# EAGLE board TestBoardExport (EAGLE 6.4)
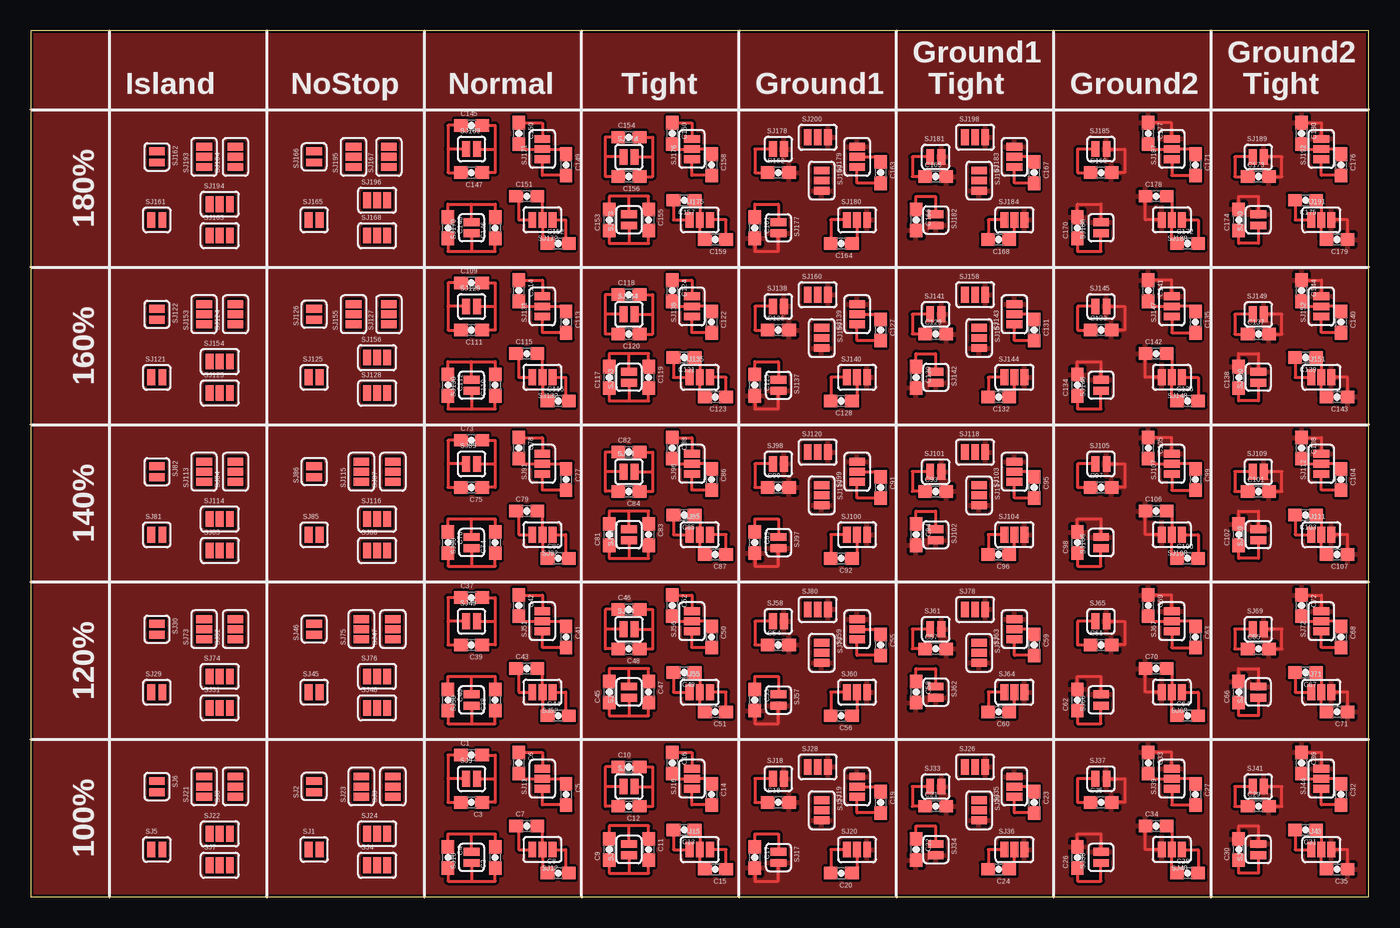
[diagram p3: board, top side]

Size 107.95 x 69.85 mm. Coordinates in mm from the lower left corner, seen from the top.
Outline: 0,0 107.95,0 107.95,69.85 0,69.85 0,0
Copper layers (1*16): Top 0.035mm / dielectric 1.5mm / Bottom 0.035mm
Design rules "SparkFun-2-layer": minimum track width 7mil, minimum drill 15mil, track to track 8mil, track to pad 8mil, pad to pad 8mil, via to via 8mil, smd to smd 8mil, copper to edge 8mil, drill to drill 8mil, minimum pad ring 12mil, minimum via ring 10mil, stop-mask expansion 4mil, vias tented up to drill 20mil, thermal gap 10mil

## Footprints (pad centres in the part's own frame; a part is rotated, then mirrored left to right if it is on the bottom)
0603-CAP = smd 1.1 x 1: 1 -0.85,0; 2 0.85,0
PAD-JUMPER-2-NO_NO_SILK = smd 0.635 x 1.27: 1 -0.45,0; 2 0.45,0
PAD-JUMPER-3-NO_YES_SILK = smd 0.635 x 1.27: 1 -0.813,0; 2 0,0; 3 0.813,0
PAD-JUMPER-3-NO_YES_SILK_ALL = smd 0.635 x 1.27: 1 -0.813,0; 2 0,0; 3 0.813,0
PAD-JUMPER-2-NO_NO_SILK_20 = smd 0.635 x 1.27: 1 -0.45,0; 2 0.45,0
PAD-JUMPER-3-NO_YES_SILK_20 = smd 0.635 x 1.27: 1 -0.813,0; 2 0,0; 3 0.813,0
PAD-JUMPER-3-NO_YES_SILK_ALL_20 = smd 0.635 x 1.27: 1 -0.813,0; 2 0,0; 3 0.813,0
PAD-JUMPER-2-NO_NO_SILK_40 = smd 0.635 x 1.27: 1 -0.45,0; 2 0.45,0
PAD-JUMPER-3-NO_YES_SILK_40 = smd 0.635 x 1.27: 1 -0.813,0; 2 0,0; 3 0.813,0
PAD-JUMPER-3-NO_YES_SILK_ALL_40 = smd 0.635 x 1.27: 1 -0.813,0; 2 0,0; 3 0.813,0
PAD-JUMPER-2-NO_NO_SILK_60 = smd 0.635 x 1.27: 1 -0.45,0; 2 0.45,0
PAD-JUMPER-3-NO_YES_SILK_60 = smd 0.635 x 1.27: 1 -0.813,0; 2 0,0; 3 0.813,0
PAD-JUMPER-3-NO_YES_SILK_ALL_60 = smd 0.635 x 1.27: 1 -0.813,0; 2 0,0; 3 0.813,0
PAD-JUMPER-2-NO_NO_SILK_80 = smd 0.635 x 1.27: 1 -0.45,0; 2 0.45,0
PAD-JUMPER-3-NO_YES_SILK_80 = smd 0.635 x 1.27: 1 -0.813,0; 2 0,0; 3 0.813,0
PAD-JUMPER-3-NO_YES_SILK_ALL_80 = smd 0.635 x 1.27: 1 -0.813,0; 2 0,0; 3 0.813,0

## Placement (x,y rotation side)
C1  0.1uF  [0603-CAP]  35.56,11.43 0 top
C2  0.1uF  [0603-CAP]  37.46,3.17 90 top
C3  0.1uF  [0603-CAP]  35.56,7.62 180 top
C4  0.1uF  [0603-CAP]  33.66,3.17 270 top
C5  0.1uF  [0603-CAP]  43.18,8.26 270 top
C6  0.1uF  [0603-CAP]  39.37,10.79 270 top
C7  0.1uF  [0603-CAP]  40.01,5.71 0 top
C8  0.1uF  [0603-CAP]  42.55,1.91 0 top
C9  0.1uF  [0603-CAP]  46.67,3.81 90 top
C10  0.1uF  [0603-CAP]  48.26,10.48 0 top
C11  0.1uF  [0603-CAP]  49.85,3.81 270 top
C12  0.1uF  [0603-CAP]  48.26,7.3 180 top
C13  0.1uF  [0603-CAP]  52.7,5.4 180 top
C14  0.1uF  [0603-CAP]  54.93,8.26 270 top
C15  0.1uF  [0603-CAP]  55.25,2.22 180 top
C16  0.1uF  [0603-CAP]  51.75,10.79 270 top
C17  0.1uF  [0603-CAP]  58.42,3.17 270 top
C18  0.1uF  [0603-CAP]  60.33,7.62 0 top
C19  0.1uF  [0603-CAP]  68.58,7.62 270 top
C20  0.1uF  [0603-CAP]  65.41,1.91 180 top
C21  0.1uF  [0603-CAP]  73.02,7.3 0 top
C22  0.1uF  [0603-CAP]  71.44,3.81 270 top
C23  0.1uF  [0603-CAP]  80.96,7.62 270 top
C24  0.1uF  [0603-CAP]  78.1,2.22 180 top
C25  0.1uF  [0603-CAP]  86.36,7.62 0 top
C26  0.1uF  [0603-CAP]  84.45,3.17 90 top
C27  0.1uF  [0603-CAP]  93.98,8.26 270 top
C28  0.1uF  [0603-CAP]  93.34,1.91 0 top
C29  0.1uF  [0603-CAP]  99.06,7.3 0 top
C30  0.1uF  [0603-CAP]  97.47,3.81 90 top
C31  0.1uF  [0603-CAP]  102.87,5.4 180 top
C32  0.1uF  [0603-CAP]  105.73,8.26 270 top
C33  0.1uF  [0603-CAP]  90.17,10.79 270 top
C34  0.1uF  [0603-CAP]  90.8,5.71 0 top
C35  0.1uF  [0603-CAP]  105.41,2.22 180 top
C36  0.1uF  [0603-CAP]  102.55,10.79 270 top
C37  0.1uF  [0603-CAP]  35.56,24.13 0 top
C38  0.1uF  [0603-CAP]  37.46,15.88 90 top
C39  0.1uF  [0603-CAP]  35.56,20.32 180 top
C40  0.1uF  [0603-CAP]  33.66,15.88 270 top
C41  0.1uF  [0603-CAP]  43.18,20.95 270 top
C42  0.1uF  [0603-CAP]  39.37,23.5 270 top
C43  0.1uF  [0603-CAP]  40.01,18.41 0 top
C44  0.1uF  [0603-CAP]  42.55,14.61 0 top
C45  0.1uF  [0603-CAP]  46.67,16.51 90 top
C46  0.1uF  [0603-CAP]  48.26,23.18 0 top
C47  0.1uF  [0603-CAP]  49.85,16.51 270 top
C48  0.1uF  [0603-CAP]  48.26,20 180 top
C49  0.1uF  [0603-CAP]  52.7,18.1 180 top
C50  0.1uF  [0603-CAP]  54.93,20.95 270 top
C51  0.1uF  [0603-CAP]  55.25,14.92 180 top
C52  0.1uF  [0603-CAP]  51.75,23.5 270 top
C53  0.1uF  [0603-CAP]  58.42,15.88 270 top
C54  0.1uF  [0603-CAP]  60.33,20.32 0 top
C55  0.1uF  [0603-CAP]  68.58,20.32 270 top
C56  0.1uF  [0603-CAP]  65.41,14.61 180 top
C57  0.1uF  [0603-CAP]  73.02,20 0 top
C58  0.1uF  [0603-CAP]  71.44,16.51 270 top
C59  0.1uF  [0603-CAP]  80.96,20.32 270 top
C60  0.1uF  [0603-CAP]  78.1,14.92 180 top
C61  0.1uF  [0603-CAP]  86.36,20.32 0 top
C62  0.1uF  [0603-CAP]  84.45,15.88 90 top
C63  0.1uF  [0603-CAP]  93.98,20.95 270 top
C64  0.1uF  [0603-CAP]  93.34,14.61 0 top
C65  0.1uF  [0603-CAP]  99.06,20 0 top
C66  0.1uF  [0603-CAP]  97.47,16.51 90 top
C67  0.1uF  [0603-CAP]  102.87,18.1 180 top
C68  0.1uF  [0603-CAP]  105.73,20.95 270 top
C69  0.1uF  [0603-CAP]  90.17,23.5 270 top
C70  0.1uF  [0603-CAP]  90.8,18.41 0 top
C71  0.1uF  [0603-CAP]  105.41,14.92 180 top
C72  0.1uF  [0603-CAP]  102.55,23.5 270 top
C73  0.1uF  [0603-CAP]  35.56,36.83 0 top
C74  0.1uF  [0603-CAP]  37.46,28.57 90 top
C75  0.1uF  [0603-CAP]  35.56,33.02 180 top
C76  0.1uF  [0603-CAP]  33.66,28.57 270 top
C77  0.1uF  [0603-CAP]  43.18,33.66 270 top
C78  0.1uF  [0603-CAP]  39.37,36.2 270 top
C79  0.1uF  [0603-CAP]  40.01,31.11 0 top
C80  0.1uF  [0603-CAP]  42.55,27.3 0 top
C81  0.1uF  [0603-CAP]  46.67,29.21 90 top
C82  0.1uF  [0603-CAP]  48.26,35.88 0 top
C83  0.1uF  [0603-CAP]  49.85,29.21 270 top
C84  0.1uF  [0603-CAP]  48.26,32.7 180 top
C85  0.1uF  [0603-CAP]  52.7,30.8 180 top
C86  0.1uF  [0603-CAP]  54.93,33.66 270 top
C87  0.1uF  [0603-CAP]  55.25,27.62 180 top
C88  0.1uF  [0603-CAP]  51.75,36.2 270 top
C89  0.1uF  [0603-CAP]  58.42,28.57 270 top
C90  0.1uF  [0603-CAP]  60.33,33.02 0 top
C91  0.1uF  [0603-CAP]  68.58,33.02 270 top
C92  0.1uF  [0603-CAP]  65.41,27.3 180 top
C93  0.1uF  [0603-CAP]  73.02,32.7 0 top
C94  0.1uF  [0603-CAP]  71.44,29.21 270 top
C95  0.1uF  [0603-CAP]  80.96,33.02 270 top
C96  0.1uF  [0603-CAP]  78.1,27.62 180 top
C97  0.1uF  [0603-CAP]  86.36,33.02 0 top
C98  0.1uF  [0603-CAP]  84.45,28.57 90 top
C99  0.1uF  [0603-CAP]  93.98,33.66 270 top
C100  0.1uF  [0603-CAP]  93.34,27.3 0 top
C101  0.1uF  [0603-CAP]  99.06,32.7 0 top
C102  0.1uF  [0603-CAP]  97.47,29.21 90 top
C103  0.1uF  [0603-CAP]  102.87,30.8 180 top
C104  0.1uF  [0603-CAP]  105.73,33.66 270 top
C105  0.1uF  [0603-CAP]  90.17,36.2 270 top
C106  0.1uF  [0603-CAP]  90.8,31.11 0 top
C107  0.1uF  [0603-CAP]  105.41,27.62 180 top
C108  0.1uF  [0603-CAP]  102.55,36.2 270 top
C109  0.1uF  [0603-CAP]  35.56,49.53 0 top
C110  0.1uF  [0603-CAP]  37.46,41.27 90 top
C111  0.1uF  [0603-CAP]  35.56,45.72 180 top
C112  0.1uF  [0603-CAP]  33.66,41.27 270 top
C113  0.1uF  [0603-CAP]  43.18,46.35 270 top
C114  0.1uF  [0603-CAP]  39.37,48.9 270 top
C115  0.1uF  [0603-CAP]  40.01,43.81 0 top
C116  0.1uF  [0603-CAP]  42.55,40.01 0 top
C117  0.1uF  [0603-CAP]  46.67,41.91 90 top
C118  0.1uF  [0603-CAP]  48.26,48.58 0 top
C119  0.1uF  [0603-CAP]  49.85,41.91 270 top
C120  0.1uF  [0603-CAP]  48.26,45.4 180 top
C121  0.1uF  [0603-CAP]  52.7,43.5 180 top
C122  0.1uF  [0603-CAP]  54.93,46.35 270 top
C123  0.1uF  [0603-CAP]  55.25,40.32 180 top
C124  0.1uF  [0603-CAP]  51.75,48.9 270 top
C125  0.1uF  [0603-CAP]  58.42,41.27 270 top
C126  0.1uF  [0603-CAP]  60.33,45.72 0 top
C127  0.1uF  [0603-CAP]  68.58,45.72 270 top
C128  0.1uF  [0603-CAP]  65.41,40.01 180 top
C129  0.1uF  [0603-CAP]  73.02,45.4 0 top
C130  0.1uF  [0603-CAP]  71.44,41.91 270 top
C131  0.1uF  [0603-CAP]  80.96,45.72 270 top
C132  0.1uF  [0603-CAP]  78.1,40.32 180 top
C133  0.1uF  [0603-CAP]  86.36,45.72 0 top
C134  0.1uF  [0603-CAP]  84.45,41.27 90 top
C135  0.1uF  [0603-CAP]  93.98,46.35 270 top
C136  0.1uF  [0603-CAP]  93.34,40.01 0 top
C137  0.1uF  [0603-CAP]  99.06,45.4 0 top
C138  0.1uF  [0603-CAP]  97.47,41.91 90 top
C139  0.1uF  [0603-CAP]  102.87,43.5 180 top
C140  0.1uF  [0603-CAP]  105.73,46.35 270 top
C141  0.1uF  [0603-CAP]  90.17,48.9 270 top
C142  0.1uF  [0603-CAP]  90.8,43.81 0 top
C143  0.1uF  [0603-CAP]  105.41,40.32 180 top
C144  0.1uF  [0603-CAP]  102.55,48.9 270 top
C145  0.1uF  [0603-CAP]  35.56,62.23 0 top
C146  0.1uF  [0603-CAP]  37.46,53.98 90 top
C147  0.1uF  [0603-CAP]  35.56,58.42 180 top
C148  0.1uF  [0603-CAP]  33.66,53.98 270 top
C149  0.1uF  [0603-CAP]  43.18,59.05 270 top
C150  0.1uF  [0603-CAP]  39.37,61.59 270 top
C151  0.1uF  [0603-CAP]  40.01,56.52 0 top
C152  0.1uF  [0603-CAP]  42.55,52.7 0 top
C153  0.1uF  [0603-CAP]  46.67,54.61 90 top
C154  0.1uF  [0603-CAP]  48.26,61.28 0 top
C155  0.1uF  [0603-CAP]  49.85,54.61 270 top
C156  0.1uF  [0603-CAP]  48.26,58.1 180 top
C157  0.1uF  [0603-CAP]  52.7,56.2 180 top
C158  0.1uF  [0603-CAP]  54.93,59.05 270 top
C159  0.1uF  [0603-CAP]  55.25,53.02 180 top
C160  0.1uF  [0603-CAP]  51.75,61.59 270 top
C161  0.1uF  [0603-CAP]  58.42,53.98 270 top
C162  0.1uF  [0603-CAP]  60.33,58.42 0 top
C163  0.1uF  [0603-CAP]  68.58,58.42 270 top
C164  0.1uF  [0603-CAP]  65.41,52.7 180 top
C165  0.1uF  [0603-CAP]  73.02,58.1 0 top
C166  0.1uF  [0603-CAP]  71.44,54.61 270 top
C167  0.1uF  [0603-CAP]  80.96,58.42 270 top
C168  0.1uF  [0603-CAP]  78.1,53.02 180 top
C169  0.1uF  [0603-CAP]  86.36,58.42 0 top
C170  0.1uF  [0603-CAP]  84.45,53.98 90 top
C171  0.1uF  [0603-CAP]  93.98,59.05 270 top
C172  0.1uF  [0603-CAP]  93.34,52.7 0 top
C173  0.1uF  [0603-CAP]  99.06,58.1 0 top
C174  0.1uF  [0603-CAP]  97.47,54.61 90 top
C175  0.1uF  [0603-CAP]  102.87,56.2 180 top
C176  0.1uF  [0603-CAP]  105.73,59.05 270 top
C177  0.1uF  [0603-CAP]  90.17,61.59 270 top
C178  0.1uF  [0603-CAP]  90.8,56.52 0 top
C179  0.1uF  [0603-CAP]  105.41,53.02 180 top
C180  0.1uF  [0603-CAP]  102.55,61.59 270 top
SJ1  JUMPER-PAD-2-NO  [PAD-JUMPER-2-NO_NO_SILK]  22.86,3.81 0 top
SJ2  JUMPER-PAD-2-NO  [PAD-JUMPER-2-NO_NO_SILK]  22.86,8.89 90 top
SJ3  JUMPER-PAD-3-NOYES_SILK  [PAD-JUMPER-3-NO_YES_SILK]  29.21,8.89 90 top
SJ4  JUMPER-PAD-3-NOYES_SILK  [PAD-JUMPER-3-NO_YES_SILK]  27.94,2.54 0 top
SJ5  JUMPER-PAD-2-NO  [PAD-JUMPER-2-NO_NO_SILK]  10.16,3.81 0 top
SJ6  JUMPER-PAD-2-NO  [PAD-JUMPER-2-NO_NO_SILK]  10.16,8.89 270 top
SJ7  JUMPER-PAD-3-NOYES_SILK  [PAD-JUMPER-3-NO_YES_SILK]  15.24,2.54 0 top
SJ8  JUMPER-PAD-3-NOYES_SILK  [PAD-JUMPER-3-NO_YES_SILK]  16.51,8.89 90 top
SJ9  JUMPER-PAD-2-NO  [PAD-JUMPER-2-NO_NO_SILK]  35.56,9.53 0 top
SJ10  JUMPER-PAD-2-NO  [PAD-JUMPER-2-NO_NO_SILK]  35.56,3.17 90 top
SJ11  JUMPER-PAD-3-NOYES_SILK  [PAD-JUMPER-3-NO_YES_SILK]  41.27,9.53 90 top
SJ12  JUMPER-PAD-3-NOYES_SILK  [PAD-JUMPER-3-NO_YES_SILK]  41.27,3.81 180 top
SJ13  JUMPER-PAD-2-NO  [PAD-JUMPER-2-NO_NO_SILK]  48.26,3.81 90 top
SJ14  JUMPER-PAD-2-NO  [PAD-JUMPER-2-NO_NO_SILK]  48.26,8.89 0 top
SJ15  JUMPER-PAD-3-NOYES_SILK  [PAD-JUMPER-3-NO_YES_SILK]  53.98,3.81 0 top
SJ16  JUMPER-PAD-3-NOYES_SILK  [PAD-JUMPER-3-NO_YES_SILK]  53.34,9.53 90 top
SJ17  JUMPER-PAD-2-NO  [PAD-JUMPER-2-NO_NO_SILK]  60.33,3.17 270 top
SJ18  JUMPER-PAD-2-NO  [PAD-JUMPER-2-NO_NO_SILK]  60.33,9.53 0 top
SJ19  JUMPER-PAD-3-NOYES_SILK  [PAD-JUMPER-3-NO_YES_SILK]  66.67,8.89 90 top
SJ20  JUMPER-PAD-3-NOYES_SILK  [PAD-JUMPER-3-NO_YES_SILK]  66.67,3.81 0 top
SJ21  JUMPER-PAD-3-NO3_0  [PAD-JUMPER-3-NO_YES_SILK_ALL]  13.97,8.89 90 top
SJ22  JUMPER-PAD-3-NO3_0  [PAD-JUMPER-3-NO_YES_SILK_ALL]  15.24,5.08 0 top
SJ23  JUMPER-PAD-3-NO3_0  [PAD-JUMPER-3-NO_YES_SILK_ALL]  26.67,8.89 90 top
SJ24  JUMPER-PAD-3-NO3_0  [PAD-JUMPER-3-NO_YES_SILK_ALL]  27.94,5.08 0 top
SJ25  JUMPER-PAD-3-NO3_0  [PAD-JUMPER-3-NO_YES_SILK_ALL]  76.52,6.99 270 top
SJ26  JUMPER-PAD-3-NO3_0  [PAD-JUMPER-3-NO_YES_SILK_ALL]  76.2,10.48 0 top
SJ27  JUMPER-PAD-3-NO3_0  [PAD-JUMPER-3-NO_YES_SILK_ALL]  63.82,6.99 270 top
SJ28  JUMPER-PAD-3-NO3_0  [PAD-JUMPER-3-NO_YES_SILK_ALL]  63.5,10.48 0 top
SJ29  JUMPER-PAD-2-NO20  [PAD-JUMPER-2-NO_NO_SILK_20]  10.16,16.51 0 top
SJ30  JUMPER-PAD-2-NO20  [PAD-JUMPER-2-NO_NO_SILK_20]  10.16,21.59 270 top
SJ31  JUMPER-PAD-3-NO2_20  [PAD-JUMPER-3-NO_YES_SILK_20]  15.24,15.24 0 top
SJ32  JUMPER-PAD-3-NO2_20  [PAD-JUMPER-3-NO_YES_SILK_20]  16.51,21.59 90 top
SJ33  JUMPER-PAD-2-NO  [PAD-JUMPER-2-NO_NO_SILK]  73.02,8.89 0 top
SJ34  JUMPER-PAD-2-NO  [PAD-JUMPER-2-NO_NO_SILK]  73.02,3.81 270 top
SJ35  JUMPER-PAD-3-NOYES_SILK  [PAD-JUMPER-3-NO_YES_SILK]  79.38,8.89 90 top
SJ36  JUMPER-PAD-3-NOYES_SILK  [PAD-JUMPER-3-NO_YES_SILK]  79.38,3.81 0 top
SJ37  JUMPER-PAD-2-NO  [PAD-JUMPER-2-NO_NO_SILK]  86.36,9.53 0 top
SJ38  JUMPER-PAD-2-NO  [PAD-JUMPER-2-NO_NO_SILK]  86.36,3.17 90 top
SJ39  JUMPER-PAD-3-NOYES_SILK  [PAD-JUMPER-3-NO_YES_SILK]  92.07,9.53 90 top
SJ40  JUMPER-PAD-3-NOYES_SILK  [PAD-JUMPER-3-NO_YES_SILK]  92.07,3.81 180 top
SJ41  JUMPER-PAD-2-NO  [PAD-JUMPER-2-NO_NO_SILK]  99.06,8.89 0 top
SJ42  JUMPER-PAD-2-NO  [PAD-JUMPER-2-NO_NO_SILK]  99.06,3.81 90 top
SJ43  JUMPER-PAD-3-NOYES_SILK  [PAD-JUMPER-3-NO_YES_SILK]  104.14,3.81 0 top
SJ44  JUMPER-PAD-3-NOYES_SILK  [PAD-JUMPER-3-NO_YES_SILK]  104.14,9.53 90 top
SJ45  JUMPER-PAD-2-NO20  [PAD-JUMPER-2-NO_NO_SILK_20]  22.86,16.51 0 top
SJ46  JUMPER-PAD-2-NO20  [PAD-JUMPER-2-NO_NO_SILK_20]  22.86,21.59 90 top
SJ47  JUMPER-PAD-3-NO2_20  [PAD-JUMPER-3-NO_YES_SILK_20]  29.21,21.59 90 top
SJ48  JUMPER-PAD-3-NO2_20  [PAD-JUMPER-3-NO_YES_SILK_20]  27.94,15.24 0 top
SJ49  JUMPER-PAD-2-NO20  [PAD-JUMPER-2-NO_NO_SILK_20]  35.56,22.23 0 top
SJ50  JUMPER-PAD-2-NO20  [PAD-JUMPER-2-NO_NO_SILK_20]  35.56,15.88 90 top
SJ51  JUMPER-PAD-3-NO2_20  [PAD-JUMPER-3-NO_YES_SILK_20]  41.27,22.23 90 top
SJ52  JUMPER-PAD-3-NO2_20  [PAD-JUMPER-3-NO_YES_SILK_20]  41.27,16.51 180 top
SJ53  JUMPER-PAD-2-NO20  [PAD-JUMPER-2-NO_NO_SILK_20]  48.26,16.51 90 top
SJ54  JUMPER-PAD-2-NO20  [PAD-JUMPER-2-NO_NO_SILK_20]  48.26,21.59 0 top
SJ55  JUMPER-PAD-3-NO2_20  [PAD-JUMPER-3-NO_YES_SILK_20]  53.98,16.51 0 top
SJ56  JUMPER-PAD-3-NO2_20  [PAD-JUMPER-3-NO_YES_SILK_20]  53.34,22.23 90 top
SJ57  JUMPER-PAD-2-NO20  [PAD-JUMPER-2-NO_NO_SILK_20]  60.33,15.88 270 top
SJ58  JUMPER-PAD-2-NO20  [PAD-JUMPER-2-NO_NO_SILK_20]  60.33,22.23 0 top
SJ59  JUMPER-PAD-3-NO2_20  [PAD-JUMPER-3-NO_YES_SILK_20]  66.67,21.59 90 top
SJ60  JUMPER-PAD-3-NO2_20  [PAD-JUMPER-3-NO_YES_SILK_20]  66.67,16.51 0 top
SJ61  JUMPER-PAD-2-NO20  [PAD-JUMPER-2-NO_NO_SILK_20]  73.02,21.59 0 top
SJ62  JUMPER-PAD-2-NO20  [PAD-JUMPER-2-NO_NO_SILK_20]  73.02,16.51 270 top
SJ63  JUMPER-PAD-3-NO2_20  [PAD-JUMPER-3-NO_YES_SILK_20]  79.38,21.59 90 top
SJ64  JUMPER-PAD-3-NO2_20  [PAD-JUMPER-3-NO_YES_SILK_20]  79.38,16.51 0 top
SJ65  JUMPER-PAD-2-NO20  [PAD-JUMPER-2-NO_NO_SILK_20]  86.36,22.23 0 top
SJ66  JUMPER-PAD-2-NO20  [PAD-JUMPER-2-NO_NO_SILK_20]  86.36,15.88 90 top
SJ67  JUMPER-PAD-3-NO2_20  [PAD-JUMPER-3-NO_YES_SILK_20]  92.07,22.23 90 top
SJ68  JUMPER-PAD-3-NO2_20  [PAD-JUMPER-3-NO_YES_SILK_20]  92.07,16.51 180 top
SJ69  JUMPER-PAD-2-NO  [PAD-JUMPER-2-NO_NO_SILK]  99.06,21.59 0 top
SJ70  JUMPER-PAD-2-NO  [PAD-JUMPER-2-NO_NO_SILK]  99.06,16.51 90 top
SJ71  JUMPER-PAD-3-NO2_20  [PAD-JUMPER-3-NO_YES_SILK_20]  104.14,16.51 0 top
SJ72  JUMPER-PAD-3-NO2_20  [PAD-JUMPER-3-NO_YES_SILK_20]  104.14,22.23 90 top
SJ73  JUMPER-PAD-3-NO3_20  [PAD-JUMPER-3-NO_YES_SILK_ALL_20]  13.97,21.59 90 top
SJ74  JUMPER-PAD-3-NO3_20  [PAD-JUMPER-3-NO_YES_SILK_ALL_20]  15.24,17.78 0 top
SJ75  JUMPER-PAD-3-NO3_20  [PAD-JUMPER-3-NO_YES_SILK_ALL_20]  26.67,21.59 90 top
SJ76  JUMPER-PAD-3-NO3_20  [PAD-JUMPER-3-NO_YES_SILK_ALL_20]  27.94,17.78 0 top
SJ77  JUMPER-PAD-3-NO3_20  [PAD-JUMPER-3-NO_YES_SILK_ALL_20]  76.52,19.68 270 top
SJ78  JUMPER-PAD-3-NO3_20  [PAD-JUMPER-3-NO_YES_SILK_ALL_20]  76.2,23.18 0 top
SJ79  JUMPER-PAD-3-NO3_20  [PAD-JUMPER-3-NO_YES_SILK_ALL_20]  63.82,19.68 270 top
SJ80  JUMPER-PAD-3-NO3_20  [PAD-JUMPER-3-NO_YES_SILK_ALL_20]  63.5,23.18 0 top
SJ81  JUMPER-PAD-2-NO40  [PAD-JUMPER-2-NO_NO_SILK_40]  10.16,29.21 0 top
SJ82  JUMPER-PAD-2-NO40  [PAD-JUMPER-2-NO_NO_SILK_40]  10.16,34.29 270 top
SJ83  JUMPER-PAD-3-NO2_40  [PAD-JUMPER-3-NO_YES_SILK_40]  15.24,27.94 0 top
SJ84  JUMPER-PAD-3-NO2_40  [PAD-JUMPER-3-NO_YES_SILK_40]  16.51,34.29 90 top
SJ85  JUMPER-PAD-2-NO40  [PAD-JUMPER-2-NO_NO_SILK_40]  22.86,29.21 0 top
SJ86  JUMPER-PAD-2-NO40  [PAD-JUMPER-2-NO_NO_SILK_40]  22.86,34.29 90 top
SJ87  JUMPER-PAD-3-NO2_40  [PAD-JUMPER-3-NO_YES_SILK_40]  29.21,34.29 90 top
SJ88  JUMPER-PAD-3-NO2_40  [PAD-JUMPER-3-NO_YES_SILK_40]  27.94,27.94 0 top
SJ89  JUMPER-PAD-2-NO40  [PAD-JUMPER-2-NO_NO_SILK_40]  35.56,34.92 0 top
SJ90  JUMPER-PAD-2-NO40  [PAD-JUMPER-2-NO_NO_SILK_40]  35.56,28.57 90 top
SJ91  JUMPER-PAD-3-NO2_40  [PAD-JUMPER-3-NO_YES_SILK_40]  41.27,34.92 90 top
SJ92  JUMPER-PAD-3-NO2_40  [PAD-JUMPER-3-NO_YES_SILK_40]  41.27,29.21 180 top
SJ93  JUMPER-PAD-2-NO40  [PAD-JUMPER-2-NO_NO_SILK_40]  48.26,29.21 90 top
SJ94  JUMPER-PAD-2-NO40  [PAD-JUMPER-2-NO_NO_SILK_40]  48.26,34.29 0 top
SJ95  JUMPER-PAD-3-NO2_40  [PAD-JUMPER-3-NO_YES_SILK_40]  53.98,29.21 0 top
SJ96  JUMPER-PAD-3-NO2_40  [PAD-JUMPER-3-NO_YES_SILK_40]  53.34,34.92 90 top
SJ97  JUMPER-PAD-2-NO40  [PAD-JUMPER-2-NO_NO_SILK_40]  60.33,28.57 270 top
SJ98  JUMPER-PAD-2-NO40  [PAD-JUMPER-2-NO_NO_SILK_40]  60.33,34.92 0 top
SJ99  JUMPER-PAD-3-NO2_40  [PAD-JUMPER-3-NO_YES_SILK_40]  66.67,34.29 90 top
SJ100  JUMPER-PAD-3-NO2_40  [PAD-JUMPER-3-NO_YES_SILK_40]  66.67,29.21 0 top
SJ101  JUMPER-PAD-2-NO40  [PAD-JUMPER-2-NO_NO_SILK_40]  73.02,34.29 0 top
SJ102  JUMPER-PAD-2-NO40  [PAD-JUMPER-2-NO_NO_SILK_40]  73.02,29.21 270 top
SJ103  JUMPER-PAD-3-NO2_40  [PAD-JUMPER-3-NO_YES_SILK_40]  79.38,34.29 90 top
SJ104  JUMPER-PAD-3-NO2_40  [PAD-JUMPER-3-NO_YES_SILK_40]  79.38,29.21 0 top
SJ105  JUMPER-PAD-2-NO40  [PAD-JUMPER-2-NO_NO_SILK_40]  86.36,34.92 0 top
SJ106  JUMPER-PAD-2-NO40  [PAD-JUMPER-2-NO_NO_SILK_40]  86.36,28.57 90 top
SJ107  JUMPER-PAD-3-NO2_40  [PAD-JUMPER-3-NO_YES_SILK_40]  92.07,34.92 90 top
SJ108  JUMPER-PAD-3-NO2_40  [PAD-JUMPER-3-NO_YES_SILK_40]  92.07,29.21 180 top
SJ109  JUMPER-PAD-2-NO40  [PAD-JUMPER-2-NO_NO_SILK_40]  99.06,34.29 0 top
SJ110  JUMPER-PAD-2-NO40  [PAD-JUMPER-2-NO_NO_SILK_40]  99.06,29.21 90 top
SJ111  JUMPER-PAD-3-NO2_40  [PAD-JUMPER-3-NO_YES_SILK_40]  104.14,29.21 0 top
SJ112  JUMPER-PAD-3-NO2_40  [PAD-JUMPER-3-NO_YES_SILK_40]  104.14,34.92 90 top
SJ113  JUMPER-PAD-3-NO3_40  [PAD-JUMPER-3-NO_YES_SILK_ALL_40]  13.97,34.29 90 top
SJ114  JUMPER-PAD-3-NO3_40  [PAD-JUMPER-3-NO_YES_SILK_ALL_40]  15.24,30.48 0 top
SJ115  JUMPER-PAD-3-NO3_40  [PAD-JUMPER-3-NO_YES_SILK_ALL_40]  26.67,34.29 90 top
SJ116  JUMPER-PAD-3-NO3_40  [PAD-JUMPER-3-NO_YES_SILK_ALL_40]  27.94,30.48 0 top
SJ117  JUMPER-PAD-3-NO3_40  [PAD-JUMPER-3-NO_YES_SILK_ALL_40]  76.52,32.38 270 top
SJ118  JUMPER-PAD-3-NO3_40  [PAD-JUMPER-3-NO_YES_SILK_ALL_40]  76.2,35.88 0 top
SJ119  JUMPER-PAD-3-NO3_40  [PAD-JUMPER-3-NO_YES_SILK_ALL_40]  63.82,32.38 270 top
SJ120  JUMPER-PAD-3-NO3_40  [PAD-JUMPER-3-NO_YES_SILK_ALL_40]  63.5,35.88 0 top
SJ121  JUMPER-PAD-2-NO60  [PAD-JUMPER-2-NO_NO_SILK_60]  10.16,41.91 0 top
SJ122  JUMPER-PAD-2-NO60  [PAD-JUMPER-2-NO_NO_SILK_60]  10.16,46.99 270 top
SJ123  JUMPER-PAD-3-NO2_60  [PAD-JUMPER-3-NO_YES_SILK_60]  15.24,40.64 0 top
SJ124  JUMPER-PAD-3-NO2_60  [PAD-JUMPER-3-NO_YES_SILK_60]  16.51,46.99 90 top
SJ125  JUMPER-PAD-2-NO60  [PAD-JUMPER-2-NO_NO_SILK_60]  22.86,41.91 0 top
SJ126  JUMPER-PAD-2-NO60  [PAD-JUMPER-2-NO_NO_SILK_60]  22.86,46.99 90 top
SJ127  JUMPER-PAD-3-NO2_60  [PAD-JUMPER-3-NO_YES_SILK_60]  28.89,46.99 90 top
SJ128  JUMPER-PAD-3-NO2_60  [PAD-JUMPER-3-NO_YES_SILK_60]  27.94,40.64 0 top
SJ129  JUMPER-PAD-2-NO60  [PAD-JUMPER-2-NO_NO_SILK_60]  35.56,47.62 0 top
SJ130  JUMPER-PAD-2-NO60  [PAD-JUMPER-2-NO_NO_SILK_60]  35.56,41.27 90 top
SJ131  JUMPER-PAD-3-NO2_60  [PAD-JUMPER-3-NO_YES_SILK_60]  41.27,47.62 90 top
SJ132  JUMPER-PAD-3-NO2_60  [PAD-JUMPER-3-NO_YES_SILK_60]  41.27,41.91 180 top
SJ133  JUMPER-PAD-2-NO60  [PAD-JUMPER-2-NO_NO_SILK_60]  48.26,41.91 90 top
SJ134  JUMPER-PAD-2-NO60  [PAD-JUMPER-2-NO_NO_SILK_60]  48.26,46.99 0 top
SJ135  JUMPER-PAD-3-NO2_60  [PAD-JUMPER-3-NO_YES_SILK_60]  53.98,41.91 0 top
SJ136  JUMPER-PAD-3-NO2_60  [PAD-JUMPER-3-NO_YES_SILK_60]  53.34,47.62 90 top
SJ137  JUMPER-PAD-2-NO60  [PAD-JUMPER-2-NO_NO_SILK_60]  60.33,41.27 270 top
SJ138  JUMPER-PAD-2-NO60  [PAD-JUMPER-2-NO_NO_SILK_60]  60.33,47.62 0 top
SJ139  JUMPER-PAD-3-NO2_60  [PAD-JUMPER-3-NO_YES_SILK_60]  66.67,46.99 90 top
SJ140  JUMPER-PAD-3-NO2_60  [PAD-JUMPER-3-NO_YES_SILK_60]  66.67,41.91 0 top
SJ141  JUMPER-PAD-2-NO60  [PAD-JUMPER-2-NO_NO_SILK_60]  73.02,46.99 0 top
SJ142  JUMPER-PAD-2-NO60  [PAD-JUMPER-2-NO_NO_SILK_60]  73.02,41.91 270 top
SJ143  JUMPER-PAD-3-NO2_60  [PAD-JUMPER-3-NO_YES_SILK_60]  79.38,46.99 90 top
SJ144  JUMPER-PAD-3-NO2_60  [PAD-JUMPER-3-NO_YES_SILK_60]  79.38,41.91 0 top
SJ145  JUMPER-PAD-2-NO60  [PAD-JUMPER-2-NO_NO_SILK_60]  86.36,47.62 0 top
SJ146  JUMPER-PAD-2-NO60  [PAD-JUMPER-2-NO_NO_SILK_60]  86.36,41.27 90 top
SJ147  JUMPER-PAD-3-NO2_60  [PAD-JUMPER-3-NO_YES_SILK_60]  92.07,47.62 90 top
SJ148  JUMPER-PAD-3-NO2_60  [PAD-JUMPER-3-NO_YES_SILK_60]  92.07,41.91 180 top
SJ149  JUMPER-PAD-2-NO60  [PAD-JUMPER-2-NO_NO_SILK_60]  99.06,46.99 0 top
SJ150  JUMPER-PAD-2-NO60  [PAD-JUMPER-2-NO_NO_SILK_60]  99.06,41.91 90 top
SJ151  JUMPER-PAD-3-NO2_60  [PAD-JUMPER-3-NO_YES_SILK_60]  104.14,41.91 0 top
SJ152  JUMPER-PAD-3-NO2_60  [PAD-JUMPER-3-NO_YES_SILK_60]  104.14,47.62 90 top
SJ153  JUMPER-PAD-3-NO3_60  [PAD-JUMPER-3-NO_YES_SILK_ALL_60]  13.97,46.99 90 top
SJ154  JUMPER-PAD-3-NO3_60  [PAD-JUMPER-3-NO_YES_SILK_ALL_60]  15.24,43.18 0 top
SJ155  JUMPER-PAD-3-NO3_60  [PAD-JUMPER-3-NO_YES_SILK_ALL_60]  26.03,46.99 90 top
SJ156  JUMPER-PAD-3-NO3_60  [PAD-JUMPER-3-NO_YES_SILK_ALL_60]  27.94,43.5 0 top
SJ157  JUMPER-PAD-3-NO3_60  [PAD-JUMPER-3-NO_YES_SILK_ALL_60]  76.52,45.09 270 top
SJ158  JUMPER-PAD-3-NO3_60  [PAD-JUMPER-3-NO_YES_SILK_ALL_60]  76.2,48.58 0 top
SJ159  JUMPER-PAD-3-NO3_60  [PAD-JUMPER-3-NO_YES_SILK_ALL_60]  63.82,45.09 270 top
SJ160  JUMPER-PAD-3-NO3_60  [PAD-JUMPER-3-NO_YES_SILK_ALL_60]  63.5,48.58 0 top
SJ161  JUMPER-PAD-2-NO80  [PAD-JUMPER-2-NO_NO_SILK_80]  10.16,54.61 0 top
SJ162  JUMPER-PAD-2-NO80  [PAD-JUMPER-2-NO_NO_SILK_80]  10.16,59.69 270 top
SJ163  JUMPER-PAD-3-NO2_80  [PAD-JUMPER-3-NO_YES_SILK_80]  15.24,53.34 0 top
SJ164  JUMPER-PAD-3-NO2_80  [PAD-JUMPER-3-NO_YES_SILK_80]  16.51,59.69 90 top
SJ165  JUMPER-PAD-2-NO80  [PAD-JUMPER-2-NO_NO_SILK_80]  22.86,54.61 0 top
SJ166  JUMPER-PAD-2-NO80  [PAD-JUMPER-2-NO_NO_SILK_80]  22.86,59.69 90 top
SJ167  JUMPER-PAD-3-NO2_80  [PAD-JUMPER-3-NO_YES_SILK_80]  28.89,59.69 90 top
SJ168  JUMPER-PAD-3-NO2_80  [PAD-JUMPER-3-NO_YES_SILK_80]  27.94,53.34 0 top
SJ169  JUMPER-PAD-2-NO80  [PAD-JUMPER-2-NO_NO_SILK_80]  35.56,60.33 0 top
SJ170  JUMPER-PAD-2-NO80  [PAD-JUMPER-2-NO_NO_SILK_80]  35.56,53.98 90 top
SJ171  JUMPER-PAD-3-NO2_80  [PAD-JUMPER-3-NO_YES_SILK_80]  41.27,60.33 90 top
SJ172  JUMPER-PAD-3-NO2_80  [PAD-JUMPER-3-NO_YES_SILK_80]  41.27,54.61 180 top
SJ173  JUMPER-PAD-2-NO80  [PAD-JUMPER-2-NO_NO_SILK_80]  48.26,54.61 90 top
SJ174  JUMPER-PAD-2-NO80  [PAD-JUMPER-2-NO_NO_SILK_80]  48.26,59.69 0 top
SJ175  JUMPER-PAD-3-NO2_80  [PAD-JUMPER-3-NO_YES_SILK_80]  53.98,54.61 0 top
SJ176  JUMPER-PAD-3-NO2_80  [PAD-JUMPER-3-NO_YES_SILK_80]  53.34,60.33 90 top
SJ177  JUMPER-PAD-2-NO80  [PAD-JUMPER-2-NO_NO_SILK_80]  60.33,53.98 270 top
SJ178  JUMPER-PAD-2-NO80  [PAD-JUMPER-2-NO_NO_SILK_80]  60.33,60.33 0 top
SJ179  JUMPER-PAD-3-NO2_80  [PAD-JUMPER-3-NO_YES_SILK_80]  66.67,59.69 90 top
SJ180  JUMPER-PAD-3-NO2_80  [PAD-JUMPER-3-NO_YES_SILK_80]  66.67,54.61 0 top
SJ181  JUMPER-PAD-2-NO80  [PAD-JUMPER-2-NO_NO_SILK_80]  73.02,59.69 0 top
SJ182  JUMPER-PAD-2-NO80  [PAD-JUMPER-2-NO_NO_SILK_80]  73.02,54.61 270 top
SJ183  JUMPER-PAD-3-NO2_80  [PAD-JUMPER-3-NO_YES_SILK_80]  79.38,59.69 90 top
SJ184  JUMPER-PAD-3-NO2_80  [PAD-JUMPER-3-NO_YES_SILK_80]  79.38,54.61 0 top
SJ185  JUMPER-PAD-2-NO80  [PAD-JUMPER-2-NO_NO_SILK_80]  86.36,60.33 0 top
SJ186  JUMPER-PAD-2-NO80  [PAD-JUMPER-2-NO_NO_SILK_80]  86.36,53.98 90 top
SJ187  JUMPER-PAD-3-NO2_80  [PAD-JUMPER-3-NO_YES_SILK_80]  92.07,60.33 90 top
SJ188  JUMPER-PAD-3-NO2_80  [PAD-JUMPER-3-NO_YES_SILK_80]  92.07,54.61 180 top
SJ189  JUMPER-PAD-2-NO80  [PAD-JUMPER-2-NO_NO_SILK_80]  99.06,59.69 0 top
SJ190  JUMPER-PAD-2-NO80  [PAD-JUMPER-2-NO_NO_SILK_80]  99.06,54.61 90 top
SJ191  JUMPER-PAD-3-NO2_80  [PAD-JUMPER-3-NO_YES_SILK_80]  104.14,54.61 0 top
SJ192  JUMPER-PAD-3-NO2_80  [PAD-JUMPER-3-NO_YES_SILK_80]  104.14,60.33 90 top
SJ193  JUMPER-PAD-3-NO3_80  [PAD-JUMPER-3-NO_YES_SILK_ALL_80]  13.97,59.69 90 top
SJ194  JUMPER-PAD-3-NO3_80  [PAD-JUMPER-3-NO_YES_SILK_ALL_80]  15.24,55.88 0 top
SJ195  JUMPER-PAD-3-NO3_80  [PAD-JUMPER-3-NO_YES_SILK_ALL_80]  26.03,59.69 90 top
SJ196  JUMPER-PAD-3-NO3_80  [PAD-JUMPER-3-NO_YES_SILK_ALL_80]  27.94,56.2 0 top
SJ197  JUMPER-PAD-3-NO3_80  [PAD-JUMPER-3-NO_YES_SILK_ALL_80]  76.52,57.78 270 top
SJ198  JUMPER-PAD-3-NO3_80  [PAD-JUMPER-3-NO_YES_SILK_ALL_80]  76.2,61.28 0 top
SJ199  JUMPER-PAD-3-NO3_80  [PAD-JUMPER-3-NO_YES_SILK_ALL_80]  63.82,57.78 270 top
SJ200  JUMPER-PAD-3-NO3_80  [PAD-JUMPER-3-NO_YES_SILK_ALL_80]  63.5,61.28 0 top

## Tracks (layer width: path | path; a pad name or v marks a point on that pad's centre or on a via)
GND
  Top 0.254: C17.2 58.42,1.27 60.33,1.27 SJ17.2 | C29.2 100.96,7.3 100.96,8.89 SJ41.2 | C30.2 97.47,5.71 99.06,5.71 SJ42.2 | C35.1 106.26,3.81 SJ43.3 | C36.1 104.14,11.64 SJ44.3 | SJ37.2 88.27,9.53 88.27,7.62 C25.2 | C26.2 84.45,5.08 86.36,5.08 SJ38.2 | SJ39.3 92.07,11.64 C33.1 | SJ40.3 89.95,3.81 C34.1 | C53.2 58.42,13.97 60.33,13.97 SJ57.2 | C65.2 100.96,20 100.96,21.59 SJ69.2 | C66.2 97.47,18.41 99.06,18.41 SJ70.2 | C71.1 106.26,16.51 SJ71.3 | C72.1 104.14,24.34 SJ72.3 | SJ65.2 88.27,22.23 88.27,20.32 C61.2 | C62.2 84.45,17.78 86.36,17.78 SJ66.2 | SJ67.3 92.07,24.34 C69.1 | SJ68.3 89.95,16.51 C70.1 | C89.2 58.42,26.67 60.33,26.67 SJ97.2 | C101.2 100.96,32.7 100.96,34.29 SJ109.2 | C102.2 97.47,31.11 99.06,31.11 SJ110.2 | C107.1 106.26,29.21 SJ111.3 | C108.1 104.14,37.05 SJ112.3 | SJ105.2 88.27,34.92 88.27,33.02 C97.2 | C98.2 84.45,30.48 86.36,30.48 SJ106.2 | SJ107.3 92.07,37.05 C105.1 | SJ108.3 89.95,29.21 C106.1 | C125.2 58.42,39.37 60.33,39.37 SJ137.2 | C137.2 100.96,45.4 100.96,46.99 SJ149.2 | C138.2 97.47,43.81 99.06,43.81 SJ150.2 | C143.1 106.26,41.91 SJ151.3 | C144.1 104.14,49.74 SJ152.3 | SJ145.2 88.27,47.62 88.27,45.72 C133.2 | C134.2 84.45,43.18 86.36,43.18 SJ146.2 | SJ147.3 92.07,49.74 C141.1 | SJ148.3 89.95,41.91 C142.1 | C161.2 58.42,52.07 60.33,52.07 SJ177.2 | C173.2 100.96,58.1 100.96,59.69 SJ189.2 | C174.2 97.47,56.52 99.06,56.52 SJ190.2 | C179.1 106.26,54.61 SJ191.3 | C180.1 104.14,62.45 SJ192.3 | SJ185.2 88.27,60.33 88.27,58.42 C169.2 | C170.2 84.45,55.88 86.36,55.88 SJ186.2 | SJ187.3 92.07,62.45 C177.1 | SJ188.3 89.95,54.61 C178.1
  pour Top: 0,69.85 107.95,69.85 107.95,0 0,0
N$1
  Top 0.254: C1.1 33.66,11.43 33.66,9.53 | 33.66,9.53 33.66,7.62 C3.2 | SJ9.1 33.66,9.53
N$2
  Top 0.254: C1.2 37.46,11.43 37.46,9.53 | 37.46,9.53 37.46,7.62 C3.1 | SJ9.2 37.46,9.53
N$3
  Top 0.254: C4.2 33.66,1.27 35.56,1.27 | 35.56,1.27 37.46,1.27 C2.1 | SJ10.1 35.56,1.27
N$4
  Top 0.254: C4.1 33.66,5.08 35.56,5.08 | 35.56,5.08 37.46,5.08 C2.2 | SJ10.2 35.56,5.08
N$5
  Top 0.254: C6.2 39.37,9.53 SJ11.2 43.18,9.53 C5.1
N$6
  Top 0.254: 41.27,8.89 SJ11.1 41.27,7.41 C5.2
N$7
  Top 0.254: C6.1 41.27,11.64 SJ11.3
N$8
  Top 0.254: C7.2 41.27,5.71 SJ12.2 41.27,1.91 C8.1
N$9
  Top 0.254: SJ12.1 43.18,3.81 43.18,1.91 C8.2
N$10
  Top 0.254: C7.1 39.37,5.71 39.37,3.81 SJ12.3
N$11
  Top 0.254: C10.2 50.16,10.48 50.16,8.89 | 50.16,8.89 50.16,7.3 C12.1 | SJ14.2 50.16,8.89
N$12
  Top 0.254: C12.2 46.36,7.3 46.36,8.89 | 46.36,8.89 46.36,10.48 C10.1 | SJ14.1 46.36,8.89
N$13
  Top 0.254: C9.1 46.67,1.91 48.26,1.91 | 48.26,1.91 49.85,1.91 C11.2 | SJ13.1 48.26,1.91
N$14
  Top 0.254: C11.1 49.85,5.71 48.26,5.71 | 48.26,5.71 46.67,5.71 C9.2 | SJ13.2 48.26,5.71
N$15
  Top 0.254: C15.2 53.98,2.22 SJ15.2 53.98,5.4 C13.1
N$16
  Top 0.254: C13.2 51.86,3.81 SJ15.1
N$17
  Top 0.254: C15.1 56.09,3.81 SJ15.3
N$18
  Top 0.254: C16.2 51.75,9.53 SJ16.2 54.93,9.53 C14.1
N$19
  Top 0.254: C14.2 53.34,7.41 SJ16.1
N$20
  Top 0.254: C16.1 53.34,11.64 SJ16.3
N$21
  Top 0.254: C17.1 58.42,5.08 60.33,5.08 SJ17.1
N$22
  Top 0.254: SJ18.1 58.42,9.53 58.42,7.62 C18.1
N$23
  Top 0.254: C37.1 33.66,24.13 33.66,22.23 | 33.66,22.23 33.66,20.32 C39.2 | SJ49.1 33.66,22.23
N$24
  Top 0.254: SJ19.2 68.58,8.89 C19.1
N$25
  Top 0.254: 66.67,8.26 SJ19.1 66.67,6.77 C19.2
N$26
  Top 0.254: SJ20.2 66.67,1.91 C20.1
N$27
  Top 0.254: 64.77,1.91 C20.2 64.55,3.81 SJ20.1
N$28
  Top 0.254: SJ33.1 71.12,8.89 71.12,7.3 C21.1
N$29
  Top 0.254: C37.2 37.46,24.13 37.46,22.23 | 37.46,22.23 37.46,20.32 C39.1 | SJ49.2 37.46,22.23
N$30
  Top 0.254: C22.1 71.44,5.71 73.02,5.71 SJ34.1
N$31
  Top 0.254: C23.1 80.96,8.89 SJ35.2
N$32
  Top 0.254: C23.2 79.38,6.77 SJ35.1
N$33
  Top 0.254: SJ36.1 77.25,3.81 C24.2
N$34
  Top 0.254: C24.1 79.38,2.22 SJ36.2
N$35
  Top 0.254: SJ37.1 84.45,9.53 84.45,7.62 C25.1
N$36
  Top 0.254: C40.2 33.66,13.97 35.56,13.97 | 35.56,13.97 37.46,13.97 C38.1 | SJ50.1 35.56,13.97
N$37
  Top 0.254: C26.1 84.45,1.27 86.36,1.27 SJ38.1
N$38
  Top 0.254: C40.1 33.66,17.78 35.56,17.78 | 35.56,17.78 37.46,17.78 C38.2 | SJ50.2 35.56,17.78
N$39
  Top 0.254: C27.1 93.98,9.53 SJ39.2 90.17,9.53 C33.2
N$40
  Top 0.254: SJ39.1 92.07,7.41 C27.2
N$41
  Top 0.254: C42.2 39.37,22.23 SJ51.2 43.18,22.23 C41.1
N$42
  Top 0.254: C28.1 92.07,1.91 SJ40.2 92.07,5.71 C34.2
N$43
  Top 0.254: SJ40.1 94.19,3.81 C28.2
N$44
  Top 0.254: 41.27,21.59 SJ51.1 41.27,20.11 C41.2
N$45
  Top 0.254: SJ41.1 97.16,8.89 97.16,7.3 C29.1
N$46
  Top 0.254: C42.1 41.27,24.34 SJ51.3
N$47
  Top 0.254: SJ42.1 99.06,1.91 97.47,1.91 C30.1
N$48
  Top 0.254: C43.2 41.27,18.41 SJ52.2 41.27,14.61 C44.1
N$49
  Top 0.254: C31.1 104.14,5.4 SJ43.2 104.14,2.22 C35.2
N$50
  Top 0.254: C31.2 102.02,3.81 SJ43.1
N$51
  Top 0.254: C32.1 105.73,9.53 SJ44.2 102.55,9.53 C36.2
N$52
  Top 0.254: C32.2 104.14,7.41 SJ44.1
N$53
  Top 0.254: SJ52.1 43.18,16.51 43.18,14.61 C44.2
N$54
  Top 0.254: C43.1 39.37,18.41 39.37,16.51 SJ52.3
N$55
  Top 0.254: C46.2 50.16,23.18 50.16,21.59 | 50.16,21.59 50.16,20 C48.1 | SJ54.2 50.16,21.59
N$56
  Top 0.254: C48.2 46.36,20 46.36,21.59 | 46.36,21.59 46.36,23.18 C46.1 | SJ54.1 46.36,21.59
N$57
  Top 0.254: C45.1 46.67,14.61 48.26,14.61 | 48.26,14.61 49.85,14.61 C47.2 | SJ53.1 48.26,14.61
N$58
  Top 0.254: C47.1 49.85,18.41 48.26,18.41 | 48.26,18.41 46.67,18.41 C45.2 | SJ53.2 48.26,18.41
N$59
  Top 0.254: C51.2 53.98,14.92 SJ55.2 53.98,18.1 C49.1
N$60
  Top 0.254: C49.2 51.86,16.51 SJ55.1
N$61
  Top 0.254: C51.1 56.09,16.51 SJ55.3
N$62
  Top 0.254: C52.2 51.75,22.23 SJ56.2 54.93,22.23 C50.1
N$63
  Top 0.254: C50.2 53.34,20.11 SJ56.1
N$64
  Top 0.254: C52.1 53.34,24.34 SJ56.3
N$65
  Top 0.254: C53.1 58.42,17.78 60.33,17.78 SJ57.1
N$66
  Top 0.254: SJ58.1 58.42,22.23 58.42,20.32 C54.1
N$67
  Top 0.254: SJ59.2 68.58,21.59 C55.1
N$68
  Top 0.254: 66.67,20.95 SJ59.1 66.67,19.47 C55.2
N$69
  Top 0.254: SJ60.2 66.67,14.61 C56.1
N$70
  Top 0.254: 64.77,14.61 C56.2 64.55,16.51 SJ60.1
N$71
  Top 0.254: SJ61.1 71.12,21.59 71.12,20 C57.1
N$72
  Top 0.254: C58.1 71.44,18.41 73.02,18.41 SJ62.1
N$73
  Top 0.254: C59.1 80.96,21.59 SJ63.2
N$74
  Top 0.254: C59.2 79.38,19.47 SJ63.1
N$75
  Top 0.254: SJ64.1 77.25,16.51 C60.2
N$76
  Top 0.254: C60.1 79.38,14.92 SJ64.2
N$77
  Top 0.254: SJ65.1 84.45,22.23 84.45,20.32 C61.1
N$78
  Top 0.254: C62.1 84.45,13.97 86.36,13.97 SJ66.1
N$79
  Top 0.254: C63.1 93.98,22.23 SJ67.2 90.17,22.23 C69.2
N$80
  Top 0.254: SJ67.1 92.07,20.11 C63.2
N$81
  Top 0.254: C64.1 92.07,14.61 SJ68.2 92.07,18.41 C70.2
N$82
  Top 0.254: SJ68.1 94.19,16.51 C64.2
N$83
  Top 0.254: SJ69.1 97.16,21.59 97.16,20 C65.1
N$84
  Top 0.254: SJ70.1 99.06,14.61 97.47,14.61 C66.1
N$85
  Top 0.254: C67.1 104.14,18.1 SJ71.2 104.14,14.92 C71.2
N$86
  Top 0.254: C67.2 102.02,16.51 SJ71.1
N$87
  Top 0.254: C68.1 105.73,22.23 SJ72.2 102.55,22.23 C72.2
N$88
  Top 0.254: C68.2 104.14,20.11 SJ72.1
N$89
  Top 0.254: C73.1 33.66,36.83 33.66,34.92 | 33.66,34.92 33.66,33.02 C75.2 | SJ89.1 33.66,34.92
N$90
  Top 0.254: C73.2 37.46,36.83 37.46,34.92 | 37.46,34.92 37.46,33.02 C75.1 | SJ89.2 37.46,34.92
N$91
  Top 0.254: C76.2 33.66,26.67 35.56,26.67 | 35.56,26.67 37.46,26.67 C74.1 | SJ90.1 35.56,26.67
N$92
  Top 0.254: C76.1 33.66,30.48 35.56,30.48 | 35.56,30.48 37.46,30.48 C74.2 | SJ90.2 35.56,30.48
N$93
  Top 0.254: C78.2 39.37,34.92 SJ91.2 43.18,34.92 C77.1
N$94
  Top 0.254: 41.27,34.29 SJ91.1 41.27,32.8 C77.2
N$95
  Top 0.254: C78.1 41.27,37.05 SJ91.3
N$96
  Top 0.254: C79.2 41.27,31.11 SJ92.2 41.27,27.3 C80.1
N$97
  Top 0.254: SJ92.1 43.18,29.21 43.18,27.3 C80.2
N$98
  Top 0.254: C79.1 39.37,31.11 39.37,29.21 SJ92.3
N$99
  Top 0.254: C82.2 50.16,35.88 50.16,34.29 | 50.16,34.29 50.16,32.7 C84.1 | SJ94.2 50.16,34.29
N$100
  Top 0.254: C84.2 46.36,32.7 46.36,34.29 | 46.36,34.29 46.36,35.88 C82.1 | SJ94.1 46.36,34.29
N$101
  Top 0.254: C81.1 46.67,27.3 48.26,27.3 | 48.26,27.3 49.85,27.3 C83.2 | SJ93.1 48.26,27.3
N$102
  Top 0.254: C83.1 49.85,31.11 48.26,31.11 | 48.26,31.11 46.67,31.11 C81.2 | SJ93.2 48.26,31.11
N$103
  Top 0.254: C87.2 53.98,27.62 SJ95.2 53.98,30.8 C85.1
N$104
  Top 0.254: C85.2 51.86,29.21 SJ95.1
N$105
  Top 0.254: C87.1 56.09,29.21 SJ95.3
N$106
  Top 0.254: C88.2 51.75,34.92 SJ96.2 54.93,34.92 C86.1
N$107
  Top 0.254: C86.2 53.34,32.8 SJ96.1
N$108
  Top 0.254: C88.1 53.34,37.05 SJ96.3
N$109
  Top 0.254: C89.1 58.42,30.48 60.33,30.48 SJ97.1
N$110
  Top 0.254: SJ98.1 58.42,34.92 58.42,33.02 C90.1
N$111
  Top 0.254: SJ99.2 68.58,34.29 C91.1
N$112
  Top 0.254: 66.67,33.66 SJ99.1 66.67,32.17 C91.2
N$113
  Top 0.254: SJ100.2 66.67,27.3 C92.1
N$114
  Top 0.254: 64.77,27.3 C92.2 64.55,29.21 SJ100.1
N$115
  Top 0.254: SJ101.1 71.12,34.29 71.12,32.7 C93.1
N$116
  Top 0.254: C94.1 71.44,31.11 73.02,31.11 SJ102.1
N$117
  Top 0.254: C95.1 80.96,34.29 SJ103.2
N$118
  Top 0.254: C95.2 79.38,32.17 SJ103.1
N$119
  Top 0.254: SJ104.1 77.25,29.21 C96.2
N$120
  Top 0.254: C96.1 79.38,27.62 SJ104.2
N$121
  Top 0.254: SJ105.1 84.45,34.92 84.45,33.02 C97.1
N$122
  Top 0.254: C98.1 84.45,26.67 86.36,26.67 SJ106.1
N$123
  Top 0.254: C99.1 93.98,34.92 SJ107.2 90.17,34.92 C105.2
N$124
  Top 0.254: SJ107.1 92.07,32.8 C99.2
N$125
  Top 0.254: C100.1 92.07,27.3 SJ108.2 92.07,31.11 C106.2
N$126
  Top 0.254: SJ108.1 94.19,29.21 C100.2
N$127
  Top 0.254: SJ109.1 97.16,34.29 97.16,32.7 C101.1
N$128
  Top 0.254: SJ110.1 99.06,27.3 97.47,27.3 C102.1
N$129
  Top 0.254: C103.1 104.14,30.8 SJ111.2 104.14,27.62 C107.2
N$130
  Top 0.254: C103.2 102.02,29.21 SJ111.1
N$131
  Top 0.254: C104.1 105.73,34.92 SJ112.2 102.55,34.92 C108.2
N$132
  Top 0.254: C104.2 104.14,32.8 SJ112.1
N$133
  Top 0.254: C109.1 33.66,49.53 33.66,47.62 | 33.66,47.62 33.66,45.72 C111.2 | SJ129.1 33.66,47.62
N$134
  Top 0.254: C109.2 37.46,49.53 37.46,47.62 | 37.46,47.62 37.46,45.72 C111.1 | SJ129.2 37.46,47.62
N$135
  Top 0.254: C112.2 33.66,39.37 35.56,39.37 | 35.56,39.37 37.46,39.37 C110.1 | SJ130.1 35.56,39.37
N$136
  Top 0.254: C112.1 33.66,43.18 35.56,43.18 | 35.56,43.18 37.46,43.18 C110.2 | SJ130.2 35.56,43.18
N$137
  Top 0.254: C114.2 39.37,47.62 SJ131.2 43.18,47.62 C113.1
N$138
  Top 0.254: 41.27,46.99 SJ131.1 41.27,45.51 C113.2
N$139
  Top 0.254: C114.1 41.27,49.74 SJ131.3
N$140
  Top 0.254: C115.2 41.27,43.81 SJ132.2 41.27,40.01 C116.1
N$141
  Top 0.254: SJ132.1 43.18,41.91 43.18,40.01 C116.2
N$142
  Top 0.254: C115.1 39.37,43.81 39.37,41.91 SJ132.3
N$143
  Top 0.254: C118.2 50.16,48.58 50.16,46.99 | 50.16,46.99 50.16,45.4 C120.1 | SJ134.2 50.16,46.99
N$144
  Top 0.254: C120.2 46.36,45.4 46.36,46.99 | 46.36,46.99 46.36,48.58 C118.1 | SJ134.1 46.36,46.99
N$145
  Top 0.254: C117.1 46.67,40.01 48.26,40.01 | 48.26,40.01 49.85,40.01 C119.2 | SJ133.1 48.26,40.01
N$146
  Top 0.254: C119.1 49.85,43.81 48.26,43.81 | 48.26,43.81 46.67,43.81 C117.2 | SJ133.2 48.26,43.81
N$147
  Top 0.254: C123.2 53.98,40.32 SJ135.2 53.98,43.5 C121.1
N$148
  Top 0.254: C121.2 51.86,41.91 SJ135.1
N$149
  Top 0.254: C123.1 56.09,41.91 SJ135.3
N$150
  Top 0.254: C124.2 51.75,47.62 SJ136.2 54.93,47.62 C122.1
N$151
  Top 0.254: C122.2 53.34,45.51 SJ136.1
N$152
  Top 0.254: C124.1 53.34,49.74 SJ136.3
N$153
  Top 0.254: C125.1 58.42,43.18 60.33,43.18 SJ137.1
N$154
  Top 0.254: SJ138.1 58.42,47.62 58.42,45.72 C126.1
N$155
  Top 0.254: SJ139.2 68.58,46.99 C127.1
N$156
  Top 0.254: 66.67,46.35 SJ139.1 66.67,44.87 C127.2
N$157
  Top 0.254: SJ140.2 66.67,40.01 C128.1
N$158
  Top 0.254: 64.77,40.01 C128.2 64.55,41.91 SJ140.1
N$159
  Top 0.254: SJ141.1 71.12,46.99 71.12,45.4 C129.1
N$160
  Top 0.254: C130.1 71.44,43.81 73.02,43.81 SJ142.1
N$161
  Top 0.254: C131.1 80.96,46.99 SJ143.2
N$162
  Top 0.254: C131.2 79.38,44.87 SJ143.1
N$163
  Top 0.254: SJ144.1 77.25,41.91 C132.2
N$164
  Top 0.254: C132.1 79.38,40.32 SJ144.2
N$165
  Top 0.254: SJ145.1 84.45,47.62 84.45,45.72 C133.1
N$166
  Top 0.254: C134.1 84.45,39.37 86.36,39.37 SJ146.1
N$167
  Top 0.254: C135.1 93.98,47.62 SJ147.2 90.17,47.62 C141.2
N$168
  Top 0.254: SJ147.1 92.07,45.51 C135.2
N$169
  Top 0.254: C136.1 92.07,40.01 SJ148.2 92.07,43.81 C142.2
N$170
  Top 0.254: SJ148.1 94.19,41.91 C136.2
N$171
  Top 0.254: SJ149.1 97.16,46.99 97.16,45.4 C137.1
N$172
  Top 0.254: SJ150.1 99.06,40.01 97.47,40.01 C138.1
N$173
  Top 0.254: C139.1 104.14,43.5 SJ151.2 104.14,40.32 C143.2
N$174
  Top 0.254: C139.2 102.02,41.91 SJ151.1
N$175
  Top 0.254: C140.1 105.73,47.62 SJ152.2 102.55,47.62 C144.2
N$176
  Top 0.254: C140.2 104.14,45.51 SJ152.1
N$177
  Top 0.254: C145.1 33.66,62.23 33.66,60.33 | 33.66,60.33 33.66,58.42 C147.2 | SJ169.1 33.66,60.33
N$178
  Top 0.254: C145.2 37.46,62.23 37.46,60.33 | 37.46,60.33 37.46,58.42 C147.1 | SJ169.2 37.46,60.33
N$179
  Top 0.254: C148.2 33.66,52.07 35.56,52.07 | 35.56,52.07 37.46,52.07 C146.1 | SJ170.1 35.56,52.07
N$180
  Top 0.254: C148.1 33.66,55.88 35.56,55.88 | 35.56,55.88 37.46,55.88 C146.2 | SJ170.2 35.56,55.88
N$181
  Top 0.254: C150.2 39.37,60.33 SJ171.2 43.18,60.33 C149.1
N$182
  Top 0.254: 41.27,59.69 SJ171.1 41.27,58.2 C149.2
N$183
  Top 0.254: C150.1 41.27,62.45 SJ171.3
N$184
  Top 0.254: C151.2 41.27,56.52 SJ172.2 41.27,52.7 C152.1
N$185
  Top 0.254: SJ172.1 43.18,54.61 43.18,52.7 C152.2
N$186
  Top 0.254: C151.1 39.37,56.52 39.37,54.61 SJ172.3
N$187
  Top 0.254: C154.2 50.16,61.28 50.16,59.69 | 50.16,59.69 50.16,58.1 C156.1 | SJ174.2 50.16,59.69
N$188
  Top 0.254: C156.2 46.36,58.1 46.36,59.69 | 46.36,59.69 46.36,61.28 C154.1 | SJ174.1 46.36,59.69
N$189
  Top 0.254: C153.1 46.67,52.7 48.26,52.7 | 48.26,52.7 49.85,52.7 C155.2 | SJ173.1 48.26,52.7
N$190
  Top 0.254: C155.1 49.85,56.52 48.26,56.52 | 48.26,56.52 46.67,56.52 C153.2 | SJ173.2 48.26,56.52
N$191
  Top 0.254: C159.2 53.98,53.02 SJ175.2 53.98,56.2 C157.1
N$192
  Top 0.254: C157.2 51.86,54.61 SJ175.1
N$193
  Top 0.254: C159.1 56.09,54.61 SJ175.3
N$194
  Top 0.254: C160.2 51.75,60.33 SJ176.2 54.93,60.33 C158.1
N$195
  Top 0.254: C158.2 53.34,58.2 SJ176.1
N$196
  Top 0.254: C160.1 53.34,62.45 SJ176.3
N$197
  Top 0.254: C161.1 58.42,55.88 60.33,55.88 SJ177.1
N$198
  Top 0.254: SJ178.1 58.42,60.33 58.42,58.42 C162.1
N$199
  Top 0.254: SJ179.2 68.58,59.69 C163.1
N$200
  Top 0.254: 66.67,59.05 SJ179.1 66.67,57.57 C163.2
N$201
  Top 0.254: SJ180.2 66.67,52.7 C164.1
N$202
  Top 0.254: 64.77,52.7 C164.2 64.55,54.61 SJ180.1
N$203
  Top 0.254: SJ181.1 71.12,59.69 71.12,58.1 C165.1
N$204
  Top 0.254: C166.1 71.44,56.52 73.02,56.52 SJ182.1
N$205
  Top 0.254: C167.1 80.96,59.69 SJ183.2
N$206
  Top 0.254: C167.2 79.38,57.57 SJ183.1
N$207
  Top 0.254: SJ184.1 77.25,54.61 C168.2
N$208
  Top 0.254: C168.1 79.38,53.02 SJ184.2
N$209
  Top 0.254: SJ185.1 84.45,60.33 84.45,58.42 C169.1
N$210
  Top 0.254: C170.1 84.45,52.07 86.36,52.07 SJ186.1
N$211
  Top 0.254: C171.1 93.98,60.33 SJ187.2 90.17,60.33 C177.2
N$212
  Top 0.254: SJ187.1 92.07,58.2 C171.2
N$213
  Top 0.254: C172.1 92.07,52.7 SJ188.2 92.07,56.52 C178.2
N$214
  Top 0.254: SJ188.1 94.19,54.61 C172.2
N$215
  Top 0.254: SJ189.1 97.16,59.69 97.16,58.1 C173.1
N$216
  Top 0.254: SJ190.1 99.06,52.7 97.47,52.7 C174.1
N$217
  Top 0.254: C175.1 104.14,56.2 SJ191.2 104.14,53.02 C179.2
N$218
  Top 0.254: C175.2 102.02,54.61 SJ191.1
N$219
  Top 0.254: C176.1 105.73,60.33 SJ192.2 102.55,60.33 C180.2
N$220
  Top 0.254: C176.2 104.14,58.2 SJ192.1

## Text on the board
tPlace: Ground1 | Ground2 | Island | NoStop | Normal | Tight | Ground1 | Tight | Ground2 | Tight | 180% | 160% | 140% | 120% | 100%